# Altium project SW 12.PrjPcb
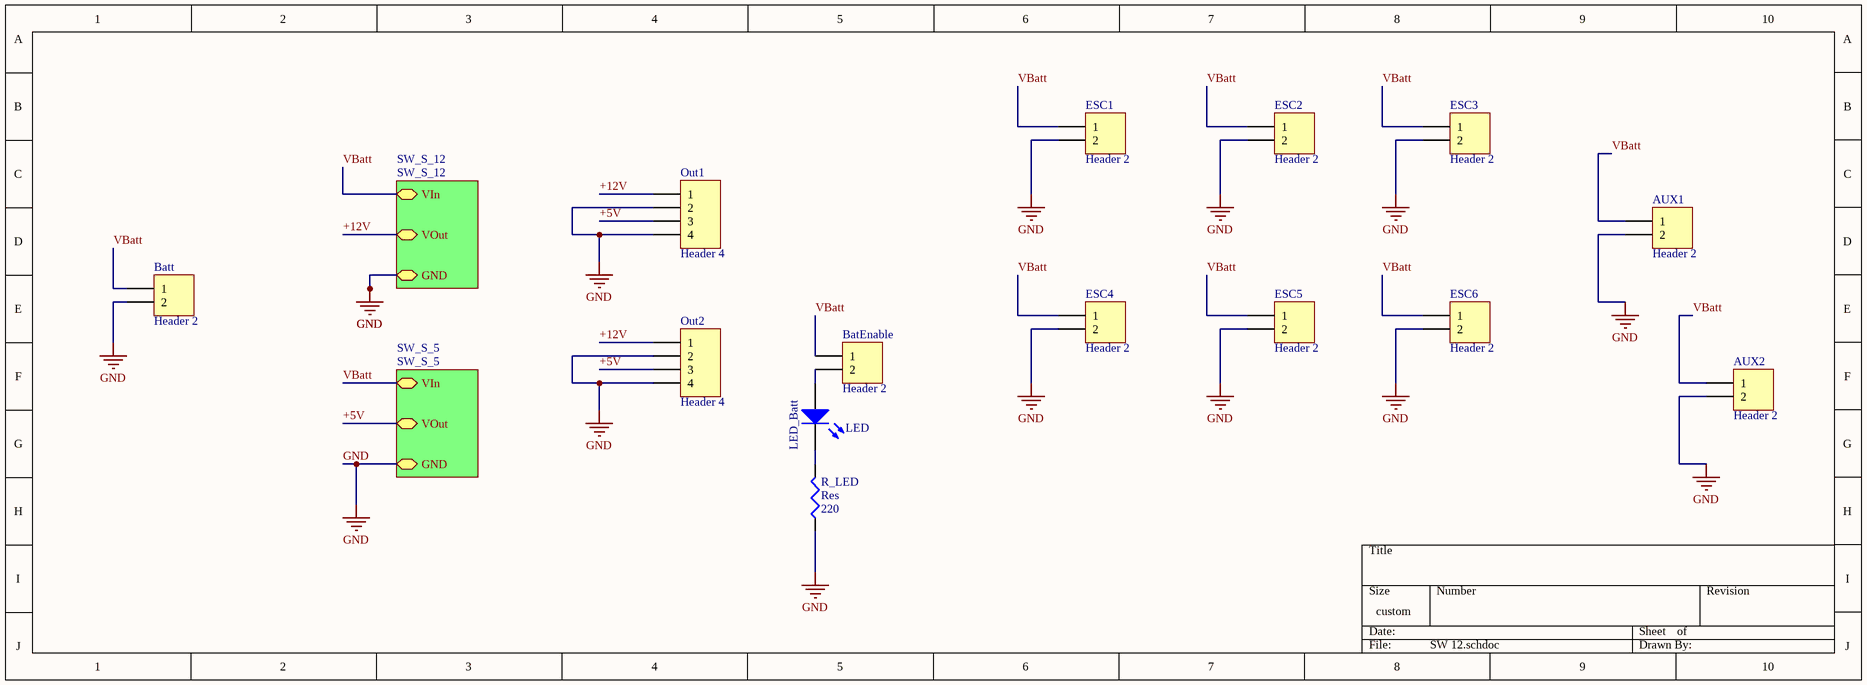
[diagram p0: SW 12.schdoc]
3 sheets, 42 parts. Net scope: hierarchical (ports join the sheet entries above them; power ports are global).
Board file: SW 12.PcbDoc
Sheets:
  SW 12.schdoc
    SW_S_12 = SW_S_12.SchDoc
    SW_S_5 = SW_S_5.SchDoc

## Sheet SW 12.schdoc
size 349 x 127 mm; SheetNumber: 1; SheetTotal: 1

### Parts
AUX1  Header 2  [14 AWG Power Footprint]
AUX2  Header 2  [14 AWG Power Footprint]
BatEnable  Header 2  [HDR1X2]
Batt  Header 2  [10 AWG Power Footprint]
ESC1  Header 2  [14 AWG Power Footprint]
ESC2  Header 2  [14 AWG Power Footprint]
ESC3  Header 2  [14 AWG Power Footprint]
ESC4  Header 2  [14 AWG Power Footprint]
ESC5  Header 2  [14 AWG Power Footprint]
ESC6  Header 2  [14 AWG Power Footprint]
LED_Batt  LED  [6-0805_L]
Out1  Header 4  [HDR1X4]
Out2  Header 4  [HDR1X4]
R_LED  Res  value 220  [6-0805_L]

### Sub-sheets
SW_S_5 = SW_S_5: VIn, GND, VOut
SW_S_12 = SW_S_12: VIn, GND, VOut

### Nets
GND: AUX1.2 AUX2.2 Batt.2 ESC1.2 ESC2.2 ESC3.2 ESC4.2 ESC5.2 ESC6.2 Out1.2 Out1.4 Out2.2 Out2.4 R_LED.1 ; sheet SW_S_12/GND, sheet SW_S_5/GND
+5V: Out1.3 Out2.3 ; sheet SW_S_5/VOut
+12V: Out1.1 Out2.1 ; sheet SW_S_12/VOut
VBatt: AUX1.1 AUX2.1 BatEnable.1 Batt.1 ESC1.1 ESC2.1 ESC3.1 ESC4.1 ESC5.1 ESC6.1 ; sheet SW_S_12/VIn, sheet SW_S_5/VIn
NetBatEnable_2: BatEnable.2 LED_Batt.1(A)
NetLED_Batt_2: LED_Batt.2(K) R_LED.2

### Library data of the parts
AUX1 AUX2 BatEnable Batt ESC1-ESC6 = Header 2: Header, 2-Pin; LatestRevisionDate: 17-Jul-2002; LatestRevisionNote: Re-released for DXP Platform.; Publisher: Altium Limited
LED_Batt = LED2: Typical RED, GREEN, YELLOW, AMBER GaAs LED; Published: 8-Jun-2000; LatestRevisionDate: 17-Jul-2002; LatestRevisionNote: Re-released for DXP Platform.; PackageVersion: Feb-2002; PackageReference: 3.2X1.6X1.1; Publisher: Altium Limited; PackageDescription: SM LED; 2 Flat Leads
Out1 Out2 = Header 4: Header, 4-Pin; LatestRevisionDate: 17-Jul-2002; LatestRevisionNote: Re-released for DXP Platform.; Publisher: Altium Limited
R_LED = Res3: Resistor; Published: 8-Jun-2000; LatestRevisionDate: 29-May-2009; LatestRevisionNote: IPC-7351 Footprint Added.; PackageReference: J1-0603; Publisher: Altium Limited; PackageDescription: Chip Resistor

## Sheet SW_S_12.SchDoc
size Tabloid
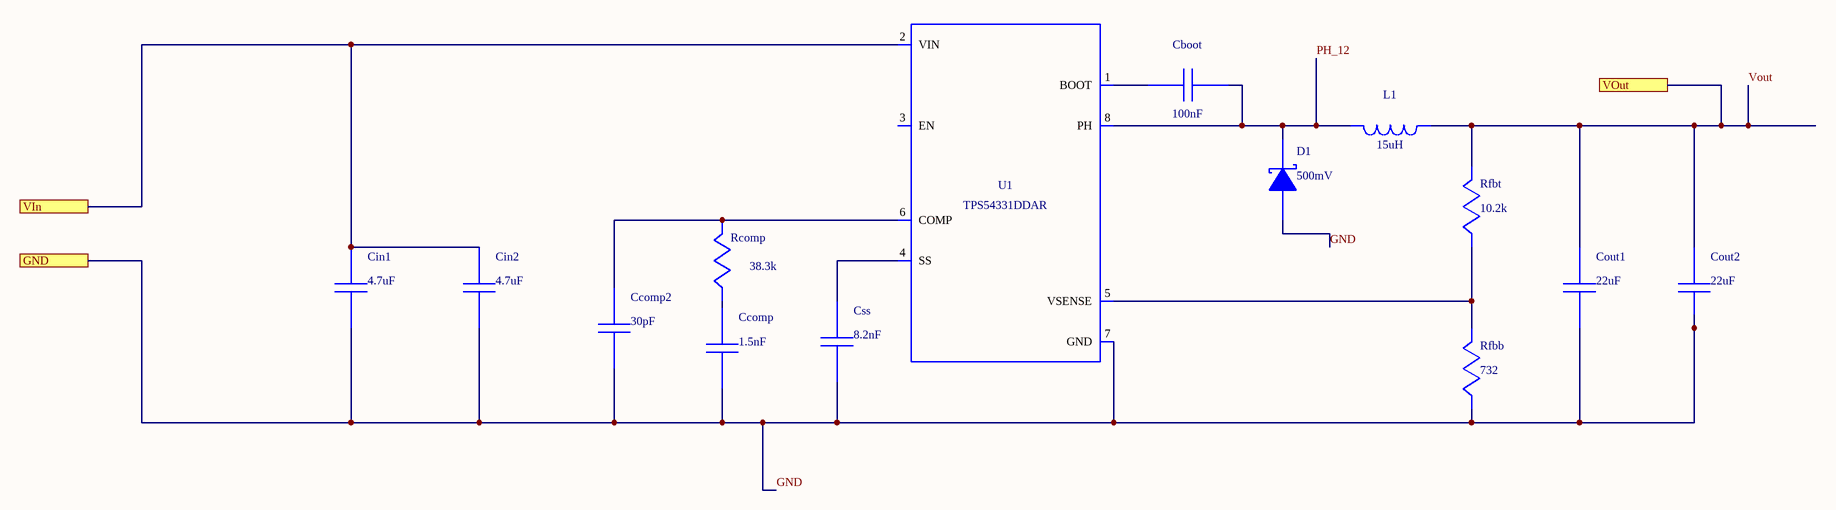
[diagram p1: SW_S_12.SchDoc]

### Parts
Cboot  value 100nF  [1608[0603]]  (hidden comment: C1608X7R1E104K)
Ccomp  value 1.5nF  [6-0805_M]  (hidden comment: CC0805KRX7R9BB152)
Ccomp2  value 30pF  [6-0805_M]  (hidden comment: CL21C300JBANNNC)
Cin1  value 4.7uF  [C1210_M]  (hidden comment: GRM32ER71H475KA88L)
Cin2  value 4.7uF  [C1210_M]  (hidden comment: GRM32ER71H475KA88L)
Cout1  value 22uF  [C1210_M]  (hidden comment: GRM32ER61E226KE15L)
Cout2  value 22uF  [C1210_M]  (hidden comment: GRM32ER61E226KE15L)
Css  value 8.2nF  [1608[0603]]  (hidden comment: GRM188R71E822KA01D)
D1  value 500mV  [SMA Diode Package]  (hidden comment: B340A-13-F)
L1  value 15uH  [SRR1260]  (hidden comment: SRR1260-150M)
Rcomp  value 38.3k  [6-0805_M]  (hidden comment: CRCW080538K3FKEA)
Rfbb  value 732  [6-0805_M]  (hidden comment: CRCW0805732RFKEA)
Rfbt  value 10.2k  [6-0805_M]  (hidden comment: CRCW080510K2FKEA)
U1  TPS54331DDAR  [TI-D8_N]

### Ports
GND, VIn, VOut

### Nets
GND: Ccomp.2 Ccomp2.2 Cin1.2 Cin2.2 Cout1.2 Cout2.2 Css.2 D1.2(A) Rfbb.2 U1.7(GND) ; port GND
PH_12: Cboot.2 D1.1(K) L1.1 U1.8(PH)
VBatt: Cin1.1 Cin2.1 U1.2(VIN) ; port VIn
Vout: Cout1.1 Cout2.1 L1.2 Rfbt.1 ; port VOut  [project net +12V]
NetCboot_1: Cboot.1 U1.1(BOOT)
NetCcomp2_1: Ccomp2.1 Rcomp.1 U1.6(COMP)
NetCcomp_1: Ccomp.1 Rcomp.2
NetCss_1: Css.1 U1.4(SS)
NetRfbb_1: Rfbb.1 Rfbt.2 U1.5(VSENSE)

Not connected (* = marked no-connect by the designer): U1 3(EN)

### Library data of the parts
Cboot = C1608X7R1E104K: Manufacturer Name: TDK; PackageReference: C1608X7R1E104K; Manufacturer Part Number: C1608X7R1E104K
Ccomp = CC0805KRX7R9BB152: CC0805KRX7R9BB15; Manufacturer Name: Yageo America; PackageReference: CC0805KRX7R9BB152; Manufacturer Part Number: CC0805KRX7R9BB152
Ccomp2 = CL21C300JBANNNC: Manufacturer Name: Samsung Electro-Mechanics; PackageReference: CL21C300JBANNNC; Manufacturer Part Number: CL21C300JBANNNC
Cin1 Cin2 = GRM32ER71H475KA88L: GRM32ER71H475KA8; Manufacturer Name: MuRata; PackageReference: GRM32ER71H475KA88L; Manufacturer Part Number: GRM32ER71H475KA88L
Cout1 Cout2 = GRM32ER61E226KE15L: GRM32ER61E226KE1; Manufacturer Name: MuRata; PackageReference: GRM32ER61E226KE15L; Manufacturer Part Number: GRM32ER61E226KE15L
Css = GRM188R71E822KA01D: GRM188R71E822KA0; Manufacturer Name: MuRata; PackageReference: GRM188R71E822KA01D; Manufacturer Part Number: GRM188R71E822KA01D
D1 = B340A-13-F: Manufacturer Name: Diodes Inc.; PackageReference: B340A-13-F; Manufacturer Part Number: B340A-13-F
L1 = SRR1260-150M: Manufacturer Name: Bourns; PackageReference: SRR1260-150M; Manufacturer Part Number: SRR1260-150M
Rcomp = CRCW080538K3FKEA: Manufacturer Name: Vishay-Dale; PackageReference: CRCW080538K3FKEA; Manufacturer Part Number: CRCW080538K3FKEA
Rfbb = CRCW0805732RFKEA: Manufacturer Name: Vishay-Dale; PackageReference: CRCW0805732RFKEA; Manufacturer Part Number: CRCW0805732RFKEA
Rfbt = CRCW080510K2FKEA: Manufacturer Name: Vishay-Dale; PackageReference: CRCW080510K2FKEA; Manufacturer Part Number: CRCW080510K2FKEA
U1 = TPS54331DDAR: Manufacturer Name: Texas Instruments; Value: UNLISTED; PackageReference: TPS54331DDAR; Manufacturer Part Number: TPS54331DDAR

## Sheet SW_S_5.SchDoc
size Tabloid
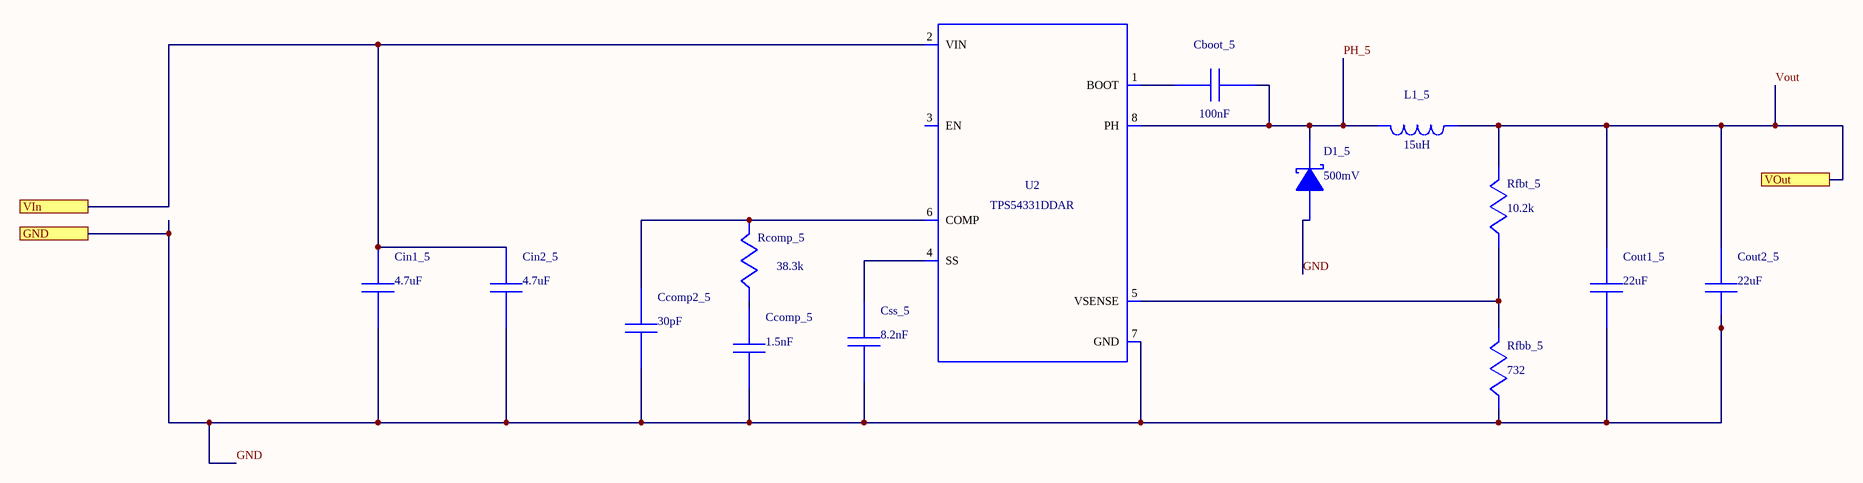
[diagram p2: SW_S_5.SchDoc]

### Parts
Cboot_5  value 100nF  [1608[0603]]  (hidden comment: C1608X7R1E104K)
Ccomp2_5  value 30pF  [6-0805_M]  (hidden comment: CL21C300JBANNNC)
Ccomp_5  value 1.5nF  [6-0805_M]  (hidden comment: CC0805KRX7R9BB152)
Cin1_5  value 4.7uF  [C1210_M]  (hidden comment: GRM32ER71H475KA88L)
Cin2_5  value 4.7uF  [C1210_M]  (hidden comment: GRM32ER71H475KA88L)
Cout1_5  value 22uF  [C1210_M]  (hidden comment: GRM32ER61E226KE15L)
Cout2_5  value 22uF  [C1210_M]  (hidden comment: GRM32ER61E226KE15L)
Css_5  value 8.2nF  [1608[0603]]  (hidden comment: GRM188R71E822KA01D)
D1_5  value 500mV  [SMA Diode Package]  (hidden comment: B340A-13-F)
L1_5  value 15uH  [SRR1260]  (hidden comment: SRR1260-150M)
Rcomp_5  value 38.3k  [6-0805_M]  (hidden comment: CRCW080538K3FKEA)
Rfbb_5  value 732  [6-0805_M]  (hidden comment: CRCW0805732RFKEA)
Rfbt_5  value 10.2k  [6-0805_M]  (hidden comment: CRCW080510K2FKEA)
U2  TPS54331DDAR  [TI-D8_N]

### Ports
GND, VIn, VOut

### Nets
GND: Ccomp2_5.2 Ccomp_5.2 Cin1_5.2 Cin2_5.2 Cout1_5.2 Cout2_5.2 Css_5.2 D1_5.2(A) Rfbb_5.2 U2.7(GND) ; port GND
PH_5: Cboot_5.2 D1_5.1(K) L1_5.1 U2.8(PH)
VBatt: Cin1_5.1 Cin2_5.1 U2.2(VIN) ; port VIn
Vout: Cout1_5.1 Cout2_5.1 L1_5.2 Rfbt_5.1 ; port VOut  [project net +5V]
NetCboot_5_1: Cboot_5.1 U2.1(BOOT)
NetCcomp2_5_1: Ccomp2_5.1 Rcomp_5.1 U2.6(COMP)
NetCcomp_5_1: Ccomp_5.1 Rcomp_5.2
NetCss_5_1: Css_5.1 U2.4(SS)
NetRfbb_5_1: Rfbb_5.1 Rfbt_5.2 U2.5(VSENSE)

Not connected (* = marked no-connect by the designer): U2 3(EN)

### Library data of the parts
Cboot_5 = C1608X7R1E104K: Manufacturer Name: TDK; PackageReference: C1608X7R1E104K; Manufacturer Part Number: C1608X7R1E104K
Ccomp2_5 = CL21C300JBANNNC: as Ccomp2 on sheet SW_S_12; PackageReference: CL21C300JBANNNC; Manufacturer Part Number: CL21C300JBANNNC
Ccomp_5 = CC0805KRX7R9BB152: as Ccomp on sheet SW_S_12; PackageReference: CC0805KRX7R9BB152; Manufacturer Part Number: CC0805KRX7R9BB152
Cin1_5 Cin2_5 = GRM32ER71H475KA88L: as Cin1 on sheet SW_S_12; PackageReference: GRM32ER71H475KA88L; Manufacturer Part Number: GRM32ER71H475KA88L
Cout1_5 Cout2_5 = GRM32ER61E226KE15L: as Cout1 on sheet SW_S_12; PackageReference: GRM32ER61E226KE15L; Manufacturer Part Number: GRM32ER61E226KE15L
Css_5 = GRM188R71E822KA01D: as Css on sheet SW_S_12; PackageReference: GRM188R71E822KA01D; Manufacturer Part Number: GRM188R71E822KA01D
D1_5 = B340A-13-F: Manufacturer Name: Diodes Inc.; PackageReference: B340A-13-F; Manufacturer Part Number: B340A-13-F
L1_5 = SRR1260-150M: Manufacturer Name: Bourns; PackageReference: SRR1260-150M; Manufacturer Part Number: SRR1260-150M
Rcomp_5 = CRCW080538K3FKEA: Manufacturer Name: Vishay-Dale; PackageReference: CRCW080538K3FKEA; Manufacturer Part Number: CRCW080538K3FKEA
Rfbb_5 = CRCW0805732RFKEA: Manufacturer Name: Vishay-Dale; PackageReference: CRCW0805732RFKEA; Manufacturer Part Number: CRCW0805732RFKEA
Rfbt_5 = CRCW080510K2FKEA: Manufacturer Name: Vishay-Dale; PackageReference: CRCW080510K2FKEA; Manufacturer Part Number: CRCW080510K2FKEA
U2 = TPS54331DDAR: as U1 on sheet SW_S_12; PackageReference: TPS54331DDAR; Manufacturer Part Number: TPS54331DDAR

## Nets that join several sheets
GND: SW 12 (14 pins), SW_S_12 (10 pins), SW_S_5 (10 pins)
+5V: SW 12 (Out1.3 Out2.3), SW_S_5 (Cout1_5.1 Cout2_5.1 L1_5.2 Rfbt_5.1)
+12V: SW 12 (Out1.1 Out2.1), SW_S_12 (Cout1.1 Cout2.1 L1.2 Rfbt.1)
VBatt: SW 12 (10 pins), SW_S_12 (Cin1.1 Cin2.1 U1.2), SW_S_5 (Cin1_5.1 Cin2_5.1 U2.2)